# Altium schematic sheet NixieAdapterIN14.SchDoc
size A3; SheetNumber: 1; SheetTotal: 1
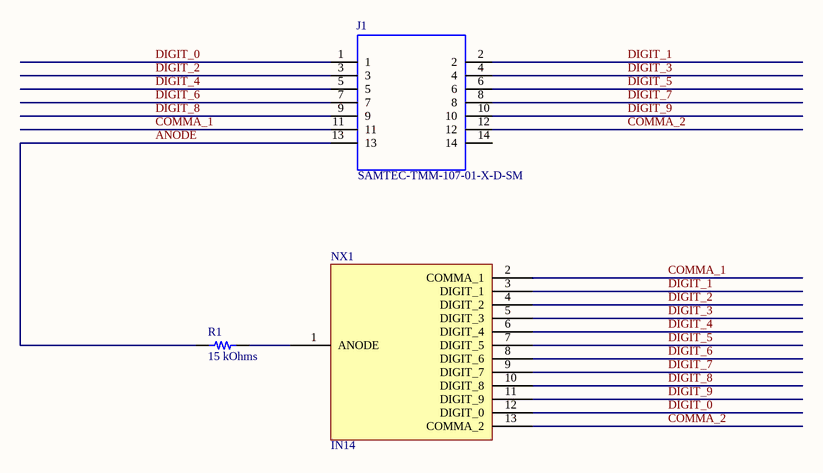
[diagram p0: NixieAdapterIN14.SchDoc]

## Parts
J1  SAMTEC-TMM-107-01-X-D-SM  [SAMTEC-TMM-107-01-X-D-SM]  (value not drawn)
NX1  IN14  [IN-14 Nixie Tube]
R1  15 kOhms  [RES 0805_2012]

## Nets
ANODE: J1.13 R1.1
COMMA_1: J1.11 NX1.2(COMMA_1)
COMMA_2: J1.12 NX1.13(COMMA_2)
DIGIT_0: J1.1 NX1.12(DIGIT_0)
DIGIT_1: J1.2 NX1.3(DIGIT_1)
DIGIT_2: J1.3 NX1.4(DIGIT_2)
DIGIT_3: J1.4 NX1.5(DIGIT_3)
DIGIT_4: J1.5 NX1.6(DIGIT_4)
DIGIT_5: J1.6 NX1.7(DIGIT_5)
DIGIT_6: J1.7 NX1.8(DIGIT_6)
DIGIT_7: J1.8 NX1.9(DIGIT_7)
DIGIT_8: J1.9 NX1.10(DIGIT_8)
DIGIT_9: J1.10 NX1.11(DIGIT_9)
NetNX1_1: NX1.1(ANODE) R1.2

Not connected (* = marked no-connect by the designer): J1 14

## Library data of the parts
NX1 = IN14: IN-14 Nixie Tube
R1 = CRCW080515K0FKEAHP: RES SMD 15K OHM 1% 1/2W 0805; Manufacturer: Vishay Dale; Power (Watts): 0.5W, 1/2W; Temperature Coefficient: ±100ppm/°C; Part Number: CRCW080515K0FKEAHP; Value: 15 kOhms; ComponentLink1Description: Datasheet; ComponentLink1URL: http://www.vishay.com/docs/20043/crcwhpe3.pdf; ComponentLink2Description: DigiKey Link; ComponentLink2URL: http://digikey.com/product-detail/en/vishay-dale/CRCW080515K0FKEAHP/541-15.0KTCT-ND/2222869; Composition: Thick Film; Device Package: 0805 (2012 Metric); Features: Automotive AEC-Q200, Pulse Withstanding; Height - Seated (Max): 0.020" (0.50mm); LastUpdated: 2/09/2020 1:15:18 am; Lifecycle Status: Active; Minimum Order: 1; Number of Terminations: 2; Operating Temperature: -55°C ~ 155°C; Package / Case: 0805 (2012 Metric); Packaging: TapeAndReel; PartId: 30346; Part Status: Active; Price: 0.03; Ratings: AEC-Q200; Resistance: 15 kOhms; Series: CRCW-HP; Size / Dimension: 0.079" L x 0.049" W (2.00mm x 1.25mm); Supplier 1: DigiKey; Supplier Part Number 1: 541-15.0KTCT-ND; Supplier Device Package: 0805; Tolerance: ±1%
J1 = SAMTEC-TMM-107-01-X-D-SM: MP: SAMTEC-TMM-107-01-X-D-SM; Price: None; Value: *; Availability: Unavailable; Package: None